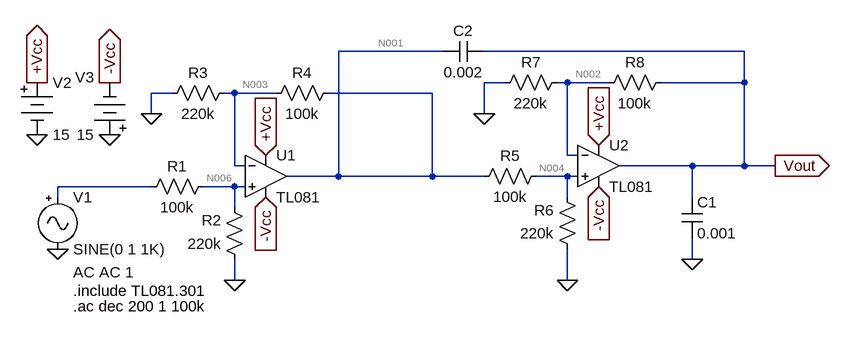
[diagram p0: schematic VCF.asc]
VCF.asc, the LTspice schematic file:
Version 4
SHEET 1 1104 680
WIRE 304 -48 144 -48
WIRE 768 -48 368 -48
WIRE 400 0 368 0
WIRE 496 0 480 0
WIRE 560 0 496 0
WIRE 768 0 768 -48
WIRE 768 0 640 0
WIRE -112 16 -144 16
WIRE -16 16 -32 16
WIRE 48 16 -16 16
WIRE 288 16 128 16
WIRE -144 48 -144 16
WIRE 368 48 368 0
WIRE 496 112 496 0
WIRE 512 112 496 112
WIRE -16 128 -16 16
WIRE 0 128 -16 128
WIRE 688 128 576 128
WIRE 768 128 768 0
WIRE 768 128 688 128
WIRE 816 128 768 128
WIRE 144 144 144 -48
WIRE 144 144 64 144
WIRE 288 144 288 16
WIRE 288 144 144 144
WIRE 368 144 288 144
WIRE 496 144 448 144
WIRE 512 144 496 144
WIRE -144 160 -288 160
WIRE -16 160 -64 160
WIRE 0 160 -16 160
WIRE -288 176 -288 160
WIRE 496 176 496 144
WIRE 688 176 688 128
WIRE -16 192 -16 160
WIRE 688 272 688 240
WIRE -16 304 -16 272
WIRE 496 304 496 256
FLAG -144 48 0
FLAG -288 256 0
FLAG -16 304 0
FLAG 32 112 +Vcc
IOPIN 32 112 In
FLAG 32 176 -Vcc
IOPIN 32 176 In
FLAG -208 80 0
FLAG -320 80 0
FLAG -320 0 +Vcc
IOPIN -320 0 Out
FLAG -208 0 -Vcc
IOPIN -208 0 Out
FLAG 496 304 0
FLAG 368 48 0
FLAG 688 272 0
FLAG 816 128 Vout
IOPIN 816 128 Out
FLAG 544 96 +Vcc
IOPIN 544 96 In
FLAG 544 160 -Vcc
IOPIN 544 160 In
SYMBOL OpAmps\\opamp2 32 80 R0
SYMATTR InstName U1
SYMATTR Value TL081
SYMBOL OpAmps\\opamp2 544 64 R0
SYMATTR InstName U2
SYMATTR Value TL081
SYMBOL res -48 144 R90
WINDOW 0 0 56 VBottom 2
WINDOW 3 32 56 VTop 2
SYMATTR InstName R1
SYMATTR Value 100k
SYMBOL res 0 288 R180
WINDOW 0 36 76 Left 2
WINDOW 3 36 40 Left 2
SYMATTR InstName R2
SYMATTR Value 220k
SYMBOL res -128 32 R270
WINDOW 0 32 56 VTop 2
WINDOW 3 0 56 VBottom 2
SYMATTR InstName R3
SYMATTR Value 220k
SYMBOL res 32 32 R270
WINDOW 0 32 56 VTop 2
WINDOW 3 0 56 VBottom 2
SYMATTR InstName R4
SYMATTR Value 100k
SYMBOL res 352 160 R270
WINDOW 0 32 56 VTop 2
WINDOW 3 0 56 VBottom 2
SYMATTR InstName R5
SYMATTR Value 100k
SYMBOL Misc\\signal -288 160 R0
WINDOW 123 24 132 Left 2
WINDOW 39 0 0 Left 0
SYMATTR Value2 AC AC 1
SYMATTR InstName V1
SYMBOL Misc\\battery -320 -16 R0
WINDOW 123 0 0 Left 0
WINDOW 39 0 0 Left 0
SYMATTR InstName V2
SYMATTR Value 15
SYMBOL Misc\\battery -208 96 R180
WINDOW 0 24 104 Left 2
WINDOW 3 24 16 Left 2
WINDOW 123 0 0 Left 0
WINDOW 39 0 0 Left 0
SYMATTR InstName V3
SYMATTR Value 15
SYMBOL res 512 272 R180
WINDOW 0 36 76 Left 2
WINDOW 3 36 40 Left 2
SYMATTR InstName R6
SYMATTR Value 220k
SYMBOL res 384 16 R270
WINDOW 0 32 56 VTop 2
WINDOW 3 0 56 VBottom 2
SYMATTR InstName R7
SYMATTR Value 220k
SYMBOL res 544 16 R270
WINDOW 0 32 56 VTop 2
WINDOW 3 0 56 VBottom 2
SYMATTR InstName R8
SYMATTR Value 100k
SYMBOL cap 672 176 R0
SYMATTR InstName C1
SYMATTR Value 0.001
SYMBOL cap 304 -32 R270
WINDOW 0 32 32 VTop 2
WINDOW 3 0 32 VBottom 2
SYMATTR InstName C2
SYMATTR Value 0.002
TEXT -264 320 Left 2 !.include TL081.301
TEXT -264 344 Left 2 !.ac dec 200 1 100k

The netlist it stands for:
* VCF.asc
XU1 N006 N003 +Vcc -Vcc N001 TL081  ; pins In+ In- V+ V- OUT
XU2 N004 N002 +Vcc -Vcc Vout TL081  ; pins In+ In- V+ V- OUT
R1 N006 N005 100k
R2 0 N006 220k
R3 0 N003 220k
R4 N003 N001 100k
R5 N001 N004 100k
V1 N005 0 SINE(0 1 1K) AC AC 1
V2 +Vcc 0 15
V3 0 -Vcc 15
R6 0 N004 220k
R7 0 N002 220k
R8 N002 Vout 100k
C1 Vout 0 0.001
C2 N001 Vout 0.002
.include TL081.301
.ac dec 200 1 100k
.backanno
.end

* Results of the author's LTspice run, read from the files saved beside the schematic
* Operating Point, zero values left out:
*   V(n001) = 15.96 µV
*   V(-vcc) = -15 V
*   V(+vcc) = 15 V
*   V(n003) = 7.873 µV
*   V(n006) = -3.097 µV
*   V(vout) = 31.91 µV
*   V(n002) = 18.84 µV
*   V(n004) = 7.873 µV
*   I(R1) = -30.97 pA
*   I(R2) = 14.08 pA
*   I(R3) = -35.79 pA
*   I(R4) = -80.84 pA
*   I(R5) = 80.84 pA
*   I(R6) = -35.79 pA
*   I(R7) = -85.65 pA
*   I(R8) = -130.7 pA
*   I(V1) = -30.97 pA
*   I(V2) = -28.39 mA
*   I(V3) = -28.39 mA
*   Ix(u1:1) = 45.05 pA
*   Ix(u1:2) = 45.05 pA
*   Ix(u1:3) = 14.19 mA
*   Ix(u1:4) = -14.19 mA
*   Ix(u1:5) = -161.7 pA
*   Ix(u2:1) = 45.05 pA
*   Ix(u2:2) = 45.05 pA
*   Ix(u2:3) = 14.19 mA
*   Ix(u2:4) = -14.19 mA
*   Ix(u2:5) = -130.7 pA
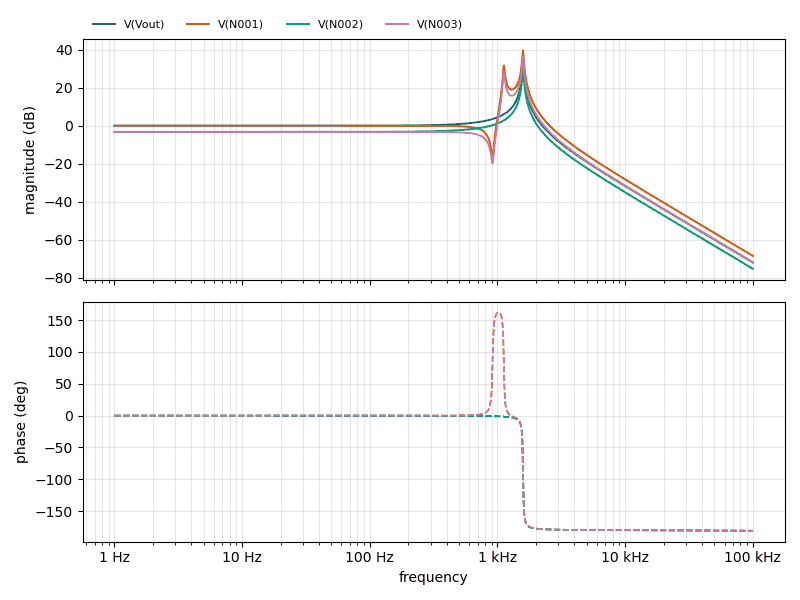
[diagram p1: AC Analysis of VCF.asc, plotted from the saved traces]
* AC Analysis, 1 run:
*   V(Vout): -0.00 dB at 1 Hz, -71.99 dB at 100 kHz, peak 33.64 dB at 1.585 kHz, 3 dB below the peak at 1.569 kHz and 1.601 kHz
*   V(N001): -0.00 dB at 1 Hz, -68.47 dB at 100 kHz, peak 39.67 dB at 1.585 kHz, 3 dB below the peak at 1.569 kHz and 1.601 kHz
*   V(N002): -3.26 dB at 1 Hz, -75.25 dB at 100 kHz, peak 30.39 dB at 1.585 kHz, 3 dB below the peak at 1.569 kHz and 1.601 kHz
*   V(N003): -3.25 dB at 1 Hz, -71.73 dB at 100 kHz, peak 36.41 dB at 1.585 kHz, 3 dB below the peak at 1.569 kHz and 1.601 kHz